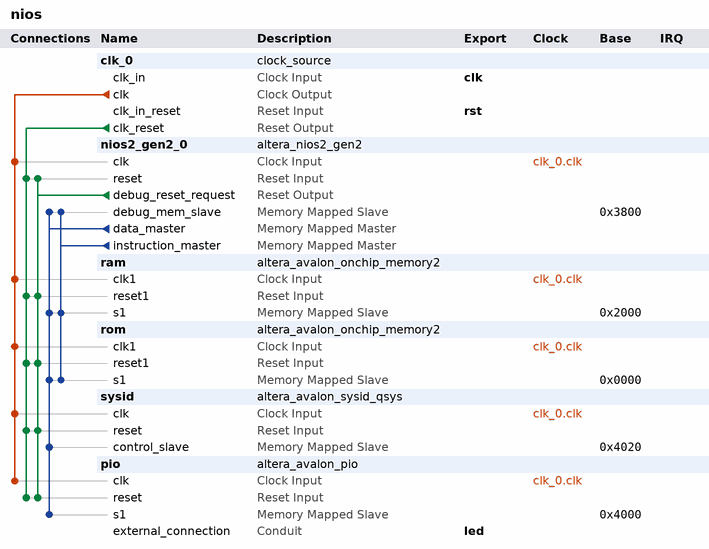
[diagram p0: system contents]
# Platform Designer (Qsys) system nios, Cyclone IV E EP4CE10F17C8
# Parameters at their usual value, and those the tool derives, are not listed.
package require -exact qsys 18.1
create_system nios
set_project_property DEVICE_FAMILY {Cyclone IV E}
set_project_property DEVICE EP4CE10F17C8

add_instance clk_0 clock_source 18.1
set_instance_parameter_value clk_0 clockFrequency 50000000

add_instance nios2_gen2_0 altera_nios2_gen2 18.1
set_instance_parameter_value nios2_gen2_0 dcache_size 2048
set_instance_parameter_value nios2_gen2_0 debug_datatrigger 4
set_instance_parameter_value nios2_gen2_0 debug_hwbreakpoint 4
set_instance_parameter_value nios2_gen2_0 debug_traceType instruction_and_data_trace
set_instance_parameter_value nios2_gen2_0 exceptionSlave ram.s1
set_instance_parameter_value nios2_gen2_0 icache_size 4096
set_instance_parameter_value nios2_gen2_0 impl Fast
set_instance_parameter_value nios2_gen2_0 resetSlave rom.s1

add_instance ram altera_avalon_onchip_memory2 18.1
set_instance_parameter_value ram dataWidth 32
set_instance_parameter_value ram dualPort false
set_instance_parameter_value ram initMemContent true
set_instance_parameter_value ram initializationFileName onchip_mem.hex
set_instance_parameter_value ram memorySize 4096

add_instance rom altera_avalon_onchip_memory2 18.1
set_instance_parameter_value rom dataWidth 32
set_instance_parameter_value rom dualPort false
set_instance_parameter_value rom initMemContent true
set_instance_parameter_value rom initializationFileName onchip_mem.hex
set_instance_parameter_value rom memorySize 4096
set_instance_parameter_value rom writable false

add_instance sysid altera_avalon_sysid_qsys 18.1
set_instance_parameter_value sysid id 305419896

add_instance pio altera_avalon_pio 18.1
set_instance_parameter_value pio bitModifyingOutReg true
set_instance_parameter_value pio direction Bidir
set_instance_parameter_value pio resetValue 31
set_instance_parameter_value pio width 5

# connections
add_connection clk_0.clk nios2_gen2_0.clk clock
add_connection clk_0.clk pio.clk clock
add_connection clk_0.clk ram.clk1 clock
add_connection clk_0.clk rom.clk1 clock
add_connection clk_0.clk sysid.clk clock
add_connection clk_0.clk_reset nios2_gen2_0.reset reset
add_connection clk_0.clk_reset pio.reset reset
add_connection clk_0.clk_reset ram.reset1 reset
add_connection clk_0.clk_reset rom.reset1 reset
add_connection clk_0.clk_reset sysid.reset reset
add_connection nios2_gen2_0.debug_reset_request nios2_gen2_0.reset reset
add_connection nios2_gen2_0.debug_reset_request pio.reset reset
add_connection nios2_gen2_0.debug_reset_request ram.reset1 reset
add_connection nios2_gen2_0.debug_reset_request rom.reset1 reset
add_connection nios2_gen2_0.debug_reset_request sysid.reset reset
add_connection nios2_gen2_0.data_master nios2_gen2_0.debug_mem_slave avalon
set_connection_parameter_value nios2_gen2_0.data_master/nios2_gen2_0.debug_mem_slave baseAddress 0x3800
add_connection nios2_gen2_0.data_master pio.s1 avalon
set_connection_parameter_value nios2_gen2_0.data_master/pio.s1 baseAddress 0x4000
add_connection nios2_gen2_0.data_master ram.s1 avalon
set_connection_parameter_value nios2_gen2_0.data_master/ram.s1 baseAddress 0x2000
add_connection nios2_gen2_0.data_master rom.s1 avalon
set_connection_parameter_value nios2_gen2_0.data_master/rom.s1 baseAddress 0x0000
add_connection nios2_gen2_0.data_master sysid.control_slave avalon
set_connection_parameter_value nios2_gen2_0.data_master/sysid.control_slave baseAddress 0x4020
add_connection nios2_gen2_0.instruction_master nios2_gen2_0.debug_mem_slave avalon
set_connection_parameter_value nios2_gen2_0.instruction_master/nios2_gen2_0.debug_mem_slave baseAddress 0x3800
add_connection nios2_gen2_0.instruction_master ram.s1 avalon
set_connection_parameter_value nios2_gen2_0.instruction_master/ram.s1 baseAddress 0x2000
add_connection nios2_gen2_0.instruction_master rom.s1 avalon
set_connection_parameter_value nios2_gen2_0.instruction_master/rom.s1 baseAddress 0x0000

# exported interfaces
add_interface clk clock sink
set_interface_property clk EXPORT_OF clk_0.clk_in
add_interface led conduit end
set_interface_property led EXPORT_OF pio.external_connection
add_interface rst reset sink
set_interface_property rst EXPORT_OF clk_0.clk_in_reset

set_interconnect_requirement {$system} qsys_mm.clockCrossingAdapter HANDSHAKE
set_interconnect_requirement {$system} qsys_mm.enableEccProtection FALSE
set_interconnect_requirement {$system} qsys_mm.insertDefaultSlave FALSE
set_interconnect_requirement {$system} qsys_mm.maxAdditionalLatency 1

save_system nios.qsys
